# Altium project Batman motor driver MIA.PrjPcb
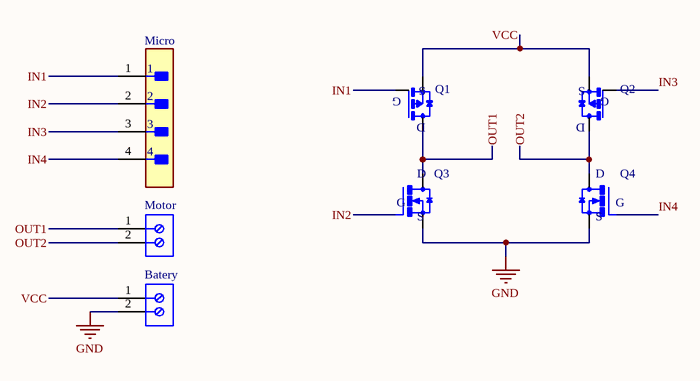
[diagram p0: motor driver.SchDoc]
1 sheet, 7 parts. Net scope: global (net labels, ports and power ports of the same name join across sheets).
Board file: PCB_motor_driver.PcbDoc

## Sheet motor driver.SchDoc
size A4; SheetNumber: 1; SheetTotal: 1

### Parts
Batery  282836-2  [TECO-282836-2_V]  (value not drawn)
Micro  M20-9990445  [FP-M20-9990445-MFG]  (value not drawn)
Motor  282836-2  [TECO-282836-2_V]  (value not drawn)
Q1  AO3401A  [SOT23]  (value not drawn)
Q2  AO3401A  [SOT23]  (value not drawn)
Q3  IRLML6344TRPBF  [SOT23]  (value not drawn)
Q4  IRLML6344TRPBF  [SOT23]  (value not drawn)

### Nets
GND: Batery.2 Q3.2(S) Q4.2(S)
IN1: Micro.1 Q1.1(G)
IN2: Micro.2 Q3.1(G)
IN3: Micro.3 Q2.1(G)
IN4: Micro.4 Q4.1(G)
OUT1: Motor.1 Q1.3(D) Q3.3(D)
OUT2: Motor.2 Q2.3(D) Q4.3(D)
VCC: Batery.1 Q1.2(S) Q2.2(S)

### Library data of the parts
Batery Motor = CMP-1684-00017-1: Female Header, Pitch 5 mm, 1 x 2 Position, Height 10 mm, Tail Length 3.5 mm, Rohs, Bulk; Manufacturer: TE Connectivity; Wire Gauge: 16-30AWG; Product Training Modules: Wire-to-BoardEurostyleTerminalBlocks; Clamp Material - Plating: Brass-NickelPlated; Voltage: 300V; Mating Orientation: HorizontalwithBoard; Current: 13.5A; Pitch: 0.197"(5.00mm); Screw Thread: M3; 3D Model: 282836-2.pdf; Other Names: 5ULV-02B / A98076; Dynamic Catalog: BuchananSeries; Number of Levels: 1; Torque - Screw: 0.68Nm(6Lb-In); Featured Product: EurostyleTerminalBlockConnectors; Positions Per Level: 2; Wire Termination: Screw-RisingCageClamp; Datasheet URL: http://www.te.com.cn/commerce/DocumentDelivery/DDEController?Action=showdoc&DocId=Catalog+Section%7F1308389_EUROSTYLE_TERMINAL_BLOCKS%7F0607%7Fpdf%7FEnglish%7FENG_CS_1308389_EUROSTYLE_TERMINAL_BLOCKS_0607.pdf%7F282836-2; Color: Green; Family: TerminalBlocks-WiretoBoard; RoHS Information: 282836-2StatementofCompliance; Standard Package: 300; Contact Material - Plating: Brass-TinPlated; Manufacturer URL: http://www.te.com; Housing Material: Polyamide(PA66),Nylon6/6; Features: Interlocking(Side); Package Description: Female Header, Pitch 5 mm, 1 x 2 Position, Height 10 mm, Tail Length 3.5 mm; Mounting Type: ThroughHole; Package Reference: THD; Packaging: Bulk; Series: Buchanan; Category: Connectors,Interconnects; Screw Material - Plating: Brass-NickelPlated
Micro = CMP-00671-05399696-1: M20-9990445 Conn Unshrouded Header HDR 4 POS 2.54mm Solder ST Thru-Hole Bulk/Loose; Insulation Resistance: 10GΩ; Connector Type: Male Pin; Voltage Rating (DC): 750V; Max Current Rating: 3A; Contact Resistance: 25mΩ; Number of Contacts: 4; Gender: Male; Color: Black; Height: 2.54mm; Contact Material: Brass, Bronze, Gold, Nickel; Orientation: Straight; Width: 12.7mm; Mount: Through Hole; Pitch: 2.54mm; Lead Pitch: 2.54mm; RoHS: Compliant; Max Operating Temperature: 105°C; Case/Package: SIL; NexarPartId: 5399696; Depth: 2.54mm; Length: 10.16mm; Current Rating: 3A; Contact Plating: Gold; Radiation Hardening: No; Contact Mating Length: 6.096mm; Voltage Rating (AC): 750V; Termination: Solder; REACH SVHC: No SVHC; Weight: 45.359237g; Number of Rows: 1; Min Operating Temperature: -40°C; Housing Material: Nylon; Housing Color: Black; Number of Positions: 4; Number of Pins: 4
Q1 Q2 = AO3401A: P-Channel 30V 4A (Ta) 1.4W (Ta) Surface Mount SOT-23-3L; MF: Alpha &; MP: AO3401A; Purchase-URL: https://pricing.snapeda.com/search/part/AO3401A/?ref=eda; Price: None; SnapEDA_Link: https://www.snapeda.com/parts/AO3401A/Alpha%20&%20Omega%20Semiconductor%20Inc./view-part/227978/?ref=snap; Package: SOT-23 Alpha &amp; Omega Semiconductor; Availability: Good; Check_prices: https://www.snapeda.com/parts/AO3401A/Alpha%20&%20Omega%20Semiconductor%20Inc./view-part/227978/?ref=eda; Value: *
Q3 Q4 = IRLML6344TRPBF: N-Channel 30V 5A (Ta) 1.3W (Ta) Surface Mount Micro3â„¢/SOT-23; MF: Infineon Technologies; Availability: In Stock; SnapEDA_Link: https://www.snapeda.com/parts/IRLML6344TRPBF/Infineon%20Technologies/view-part/1786730/?ref=snap; MP: IRLML6344TRPBF; Value: *; Price: None; Package: SOT-23 Multicomp; Check_prices: https://www.snapeda.com/parts/IRLML6344TRPBF/Infineon%20Technologies/view-part/1786730/?ref=eda; Purchase-URL: https://pricing.snapeda.com/search/part/IRLML6344TRPBF/?ref=eda